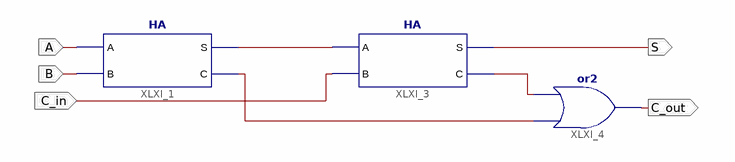
[diagram p0: schematic sheet 1]
// Xilinx ISE schematic FA.sch (spartan3e) as structural Verilog: 3 symbols, 5 ports
module FA (
  input  C_in,
  input  A,
  input  B,
  output S,
  output C_out
);

  wire XLXN_1, XLXN_6, XLXN_11;

  HA XLXI_1 (.A(A), .B(B), .C(XLXN_6), .S(XLXN_1));
  HA XLXI_3 (.A(XLXN_1), .B(C_in), .C(XLXN_11), .S(S));
  or XLXI_4 (C_out, XLXN_6, XLXN_11);
endmodule
